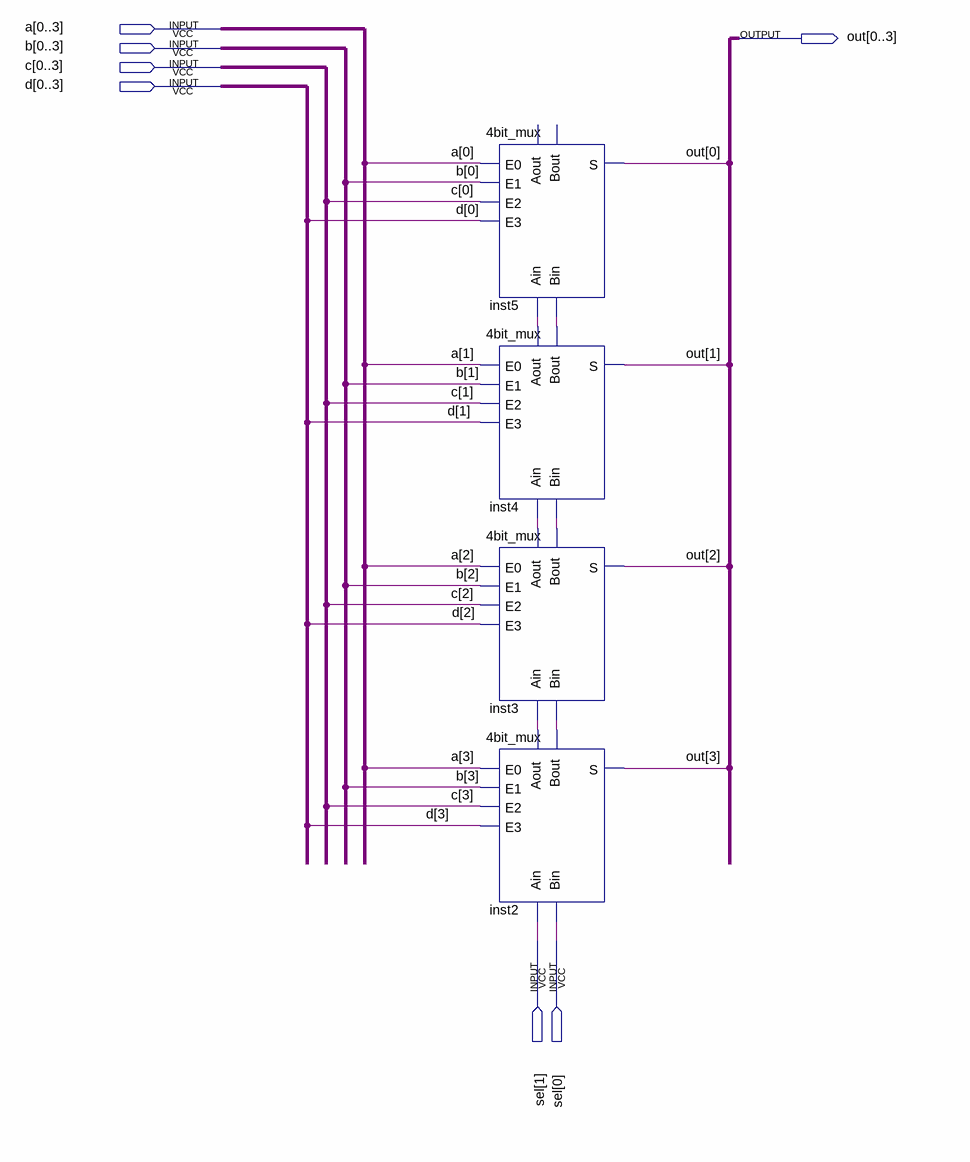
[diagram p0: schematic sheet]
// Quartus schematic 4bit_mux5.bdf as structural Verilog: 4 symbols, 7 pins
module \4bit_mux5  (
  input  [0:3] a,
  input  [0:3] b,
  input  [0:3] c,
  input  [0:3] d,
  input  [1:0] sel,
  output [0:3] out
);

  wire inst2_aout, inst2_bout, inst3_aout, inst3_bout, inst4_aout, inst4_bout;

  \4bit_mux  inst5 (
    .E0(a[0]), .E1(b[0]), .E2(c[0]), .E3(d[0]), .Ain(inst4_aout), .Bin(inst4_bout), .S(out[0]));  // open: Aout, Bout
  \4bit_mux  inst4 (
    .E0(a[1]), .E1(b[1]), .E2(c[1]), .E3(d[1]), .Ain(inst3_aout), .Bin(inst3_bout), .S(out[1]),
    .Aout(inst4_aout), .Bout(inst4_bout));
  \4bit_mux  inst3 (
    .E0(a[2]), .E1(b[2]), .E2(c[2]), .E3(d[2]), .Ain(inst2_aout), .Bin(inst2_bout), .S(out[2]),
    .Aout(inst3_aout), .Bout(inst3_bout));
  \4bit_mux  inst2 (
    .E0(a[3]), .E1(b[3]), .E2(c[3]), .E3(d[3]), .Ain(sel[1]), .Bin(sel[0]), .S(out[3]), .Aout(inst2_aout),
    .Bout(inst2_bout));
endmodule
